# EAGLE design pico test (EAGLE 7.1.0)
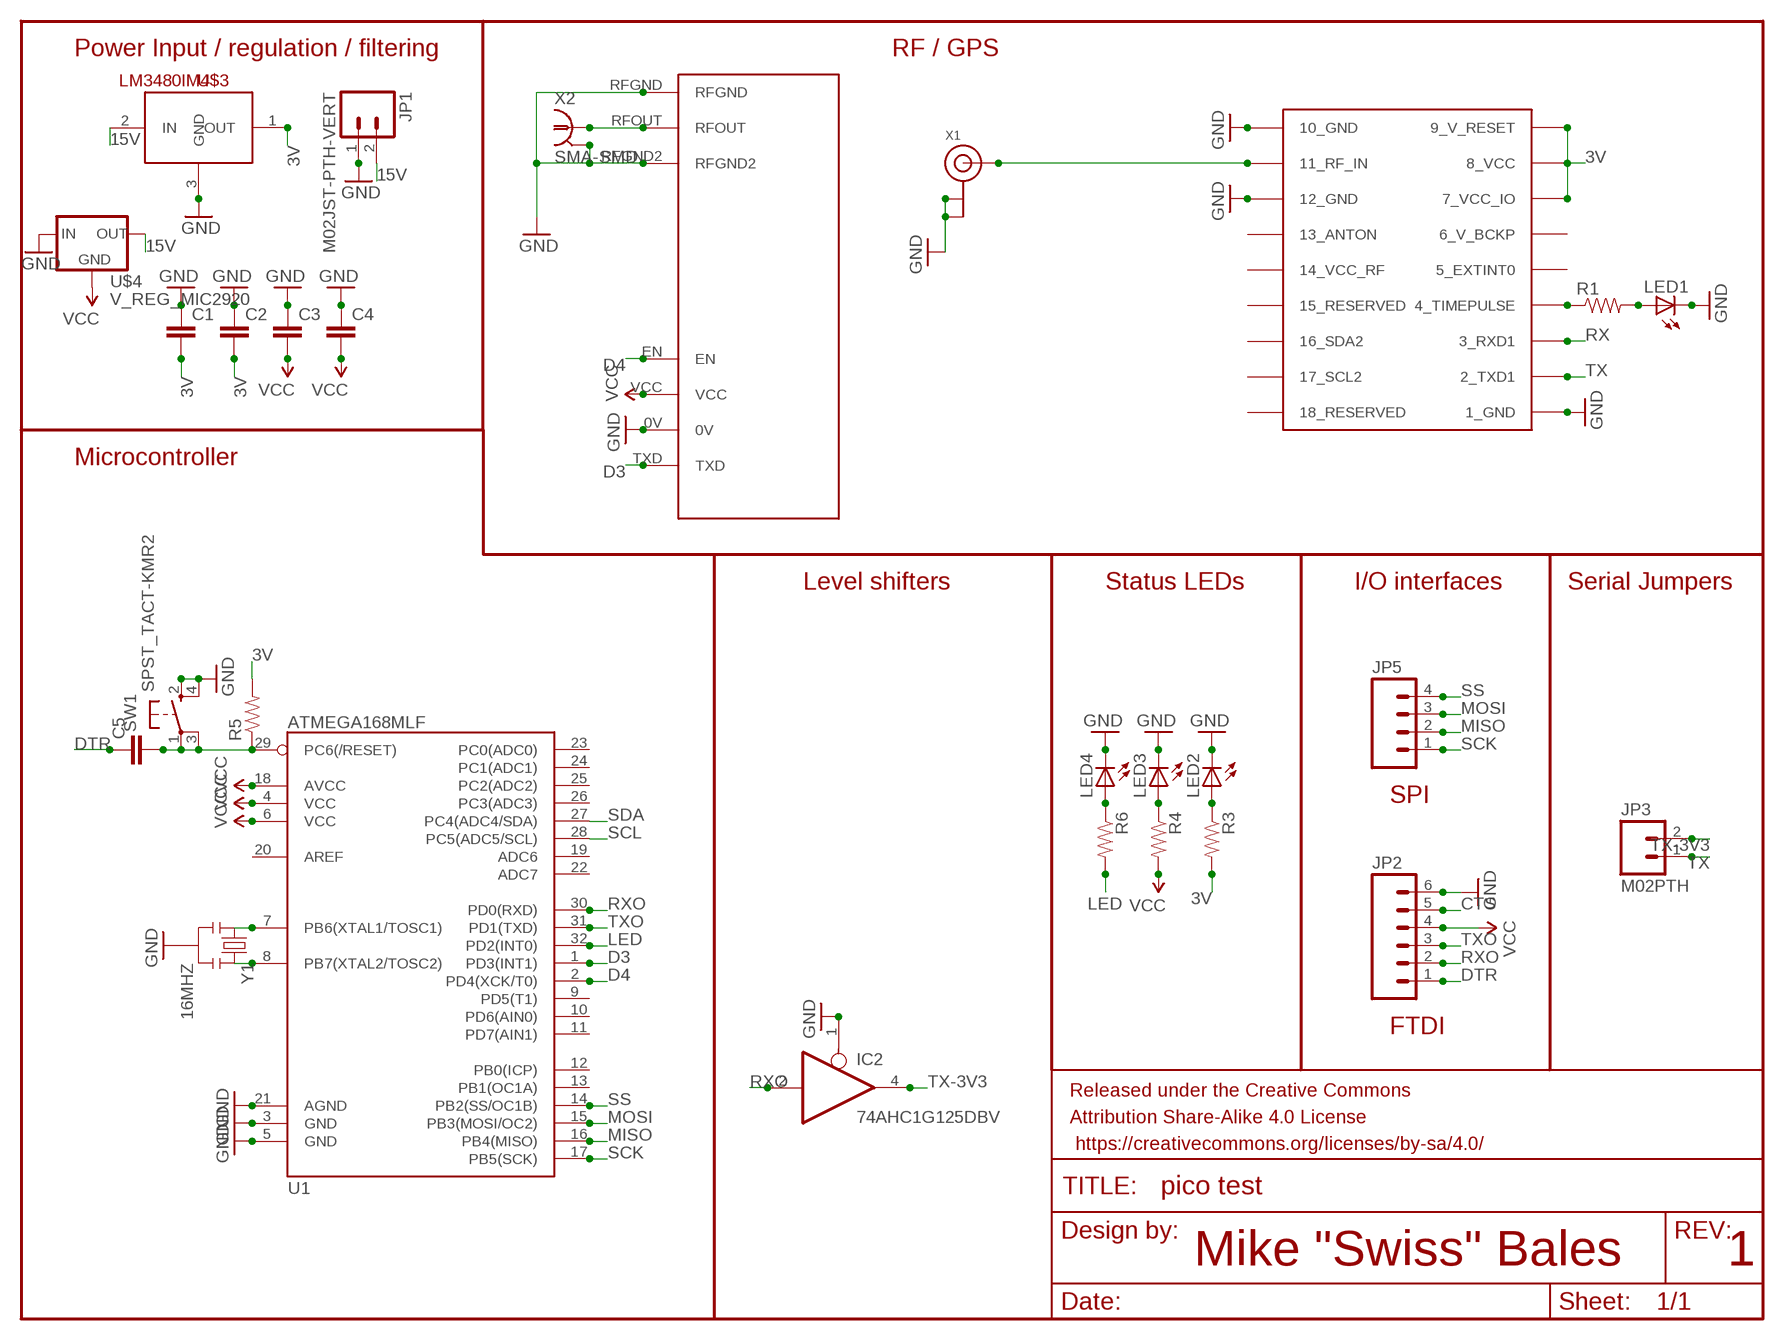
[diagram p0: schematic, sheet 1]

## Parts
C1  CAP0805  [0805]
C2  CAP0805  [0805]
C3  CAP0805  [0805]
C4  CAP0805  [0805]
C5  CAP0805  [0805]
FRAME1  FRAME-LETTER  [CREATIVE_COMMONS]
IC2  74AHC1G125DBV  [SOT23-5]
JP1  M02JST-PTH-VERT  [JST-2-PTH-VERT]
JP2  M06NO_SILK_FEMALE_PTH  [1X06_NO_SILK]
JP3  M02PTH  [1X02]
JP5  M041X04_NO_SILK  [1X04_NO_SILK]
LED1  LEDCHIP-LED0805  [CHIP-LED0805]
LED2  LEDCHIP-LED0805  [CHIP-LED0805]
LED3  LEDCHIP-LED0805  [CHIP-LED0805]
LED4  LEDCHIP-LED0805  [CHIP-LED0805]
R1  RESISTOR0805-RES  [0805]
R3  RESISTOR0805-RES  [0805]
R4  RESISTOR0805-RES  [0805]
R5  RESISTOR0805-RES  [0805]
R6  RESISTOR0805-RES  [0805]
SW1  SPST_TACT-KMR2  [KMR2]
U1  ATMEGA168MLF  [MLF32]
U$1  UBLOX_MAX  [UBLOX_MAX]
U$2  RADIOMETRIX-HX1  [RADIOMETRIX-HX1]
U$3  LM3480IM4  [SOT23-3]
U$4  V_REG_MIC2920  [SOT223]
X1  ANTENNA_U.FL  [U.FL]
X2  SMA-SMD  [SMA-SMD]
Y1  16MHZ  RESONATOR16MHZ  [RESONATOR-SMD]

## Nets
3V: C1.2 C2.2 R3.2 R5.2 U$1.7_VCC_IO U$1.8_VCC U$1.9_V_RESET U$3.1(OUT)
15V: JP1.2 U$3.2(IN) U$4.3(OUT)
CTS: JP2.5
D3: U1.1(PD3(INT1)) U$2.TXD
D4: U1.2(PD4(XCK/T0)) U$2.EN
DTR: C5.1 JP2.1
GND: C1.1 C2.1 C3.1 C4.1 IC2.1(OE) JP1.1 JP2.6 LED1.C LED2.C LED3.C LED4.C SW1.2(S) SW1.4(S1) U1.3(GND) U1.5(GND) U1.21(AGND) U$1.1_GND U$1.10_GND U$1.12_GND U$2.0V U$2.RFGND U$2.RFGND2 U$3.3(GND) U$4.1(IN) X1.1(GND) X1.2(GND) X2.2@1 X2.2@2 X2.2@3 X2.2@4 X2.2@5 X2.2@6 Y1.2
LED: R6.2 U1.32(PD2(INT0))
MISO: JP5.2 U1.16(PB4(MISO))
MOSI: JP5.3 U1.15(PB3(MOSI/OC2))
N$1: U$2.RFOUT X2.1
N$2: R1.1 U$1.4_TIMEPULSE
N$3: LED1.A R1.2
N$6: U$1.11_RF_IN X1.3(SIGNAL)
N$7: LED2.A R3.1
N$8: LED3.A R4.1
N$9: C5.2 R5.1 SW1.1(P) SW1.3(P1) U1.29(PC6(/RESET))
N$14: U1.8(PB7(XTAL2/TOSC2)) Y1.3
N$26: U1.7(PB6(XTAL1/TOSC1)) Y1.1
N$27: LED4.A R6.1
RX: U$1.3_RXD1
RXO: IC2.2(I) JP2.2 U1.30(PD0(RXD))
SCK: JP5.1 U1.17(PB5(SCK))
SCL: U1.28(PC5(ADC5/SCL))
SDA: U1.27(PC4(ADC4/SDA))
SS: JP5.4 U1.14(PB2(SS/OC1B))
TX: JP3.1 U$1.2_TXD1
TX-3V3: IC2.4(O) JP3.2
TXO: JP2.3 U1.31(PD1(TXD))
VCC: C3.2 C4.2 JP2.4 R4.2 U1.4(VCC) U1.6(VCC) U1.18(AVCC) U$2.VCC U$4.2(GND)
Unconnected: U1.9(PD5(T1)) U1.10(PD6(AIN0)) U1.11(PD7(AIN1)) U1.12(PB0(ICP)) U1.13(PB1(OC1A)) U1.19(ADC6) U1.20(AREF) U1.22(ADC7) U1.23(PC0(ADC0)) U1.24(PC1(ADC1)) U1.25(PC2(ADC2)) U1.26(PC3(ADC3)) U$1.5_EXTINT0 U$1.6_V_BCKP U$1.13_ANTON U$1.14_VCC_RF U$1.15_RESERVED U$1.16_SDA2 U$1.17_SCL2 U$1.18_RESERVED

## Notes on the sheet
- Power Input / regulation / filtering | RF / GPS
- Microcontroller
- Level shifters | Status LEDs | I/O interfaces | Serial Jumpers
- SPI
- FTDI
- Mike "Swiss" Bales | 1

## Power pins joined to a net without a drawn wire
GND: IC2.3(GND)
VCC: IC2.5(VCC)

## Library data of the parts
C1-C5 = SparkFun-Capacitors:CAP: Capacitor Standard 0603 ceramic capacitor, and 0.1" leaded capacitor.
FRAME1 = SparkFun-Aesthetics:FRAME-LETTER: Schematic Frame Standard 8.5x11 US Letter frame
IC2 = 74xx-little-us:74*1G125: Single Bus Buffer Gate with 3-State Output
JP1 JP3 = SparkFun-Connectors:M02: Standard 2-pin 0.1" header. Use with - straight break away headers ( PRT-00116) - right angle break away headers (PRT-00553) - swiss pins (PRT-00743) - machine pins (PRT-00117) - female headers (PRT-00115) Molex polarized connector foot print use with: PRT-08233 with associated crimp pins and housings. 2.54_SCREWTERM for use with PRT-10571. 3.5mm Screw Terminal footprints for PRT-08084 5mm Screw Terminal footprints for use with PRT-08432
JP2 = SparkFun-Connectors:M06: Header 6 Standard 6-pin 0.1" header. Use with straight break away headers (SKU : PRT-00116), right angle break away headers (PRT-00553), swiss pins (PRT-00743), machine pins (PRT-00117), and female headers (PRT-00115). Molex polarized connector foot print use with SKU : PRT-08094 with associated crimp pins and housings. NOTES ON THE VARIANTS LOCK and LOCK_LONGPADS... This footprint was designed to help hold the alignment of a through-hole component (i.e. 6-pin header) while soldering it into place. You may notice that each hole has been shifted either up or down by 0.005 of an inch from it's more standard position (which is a perfectly straight line). This slight alteration caused the pins (the squares in the middle) to touch the edges of the holes. Because they are alternating, it causes a "brace" to hold the component in place. 0.005 has proven to be the perfect amount of "off-center" position when using our standard breakaway headers. Although looks a little odd when you look at the bare footprint, once you have a header in there, the alteration is very hard to notice. Also,if you push a header all the way into place, it is covered up entirely on the bottom side. This idea of altering the position of holes to aid alignment will be further integrated into the Sparkfun Library for other footprints. It can help hold any component with 3 or more connection pins.; PROD_ID: CONN-08437
JP5 = SparkFun-Connectors:M04: Header 4 Standard 4-pin 0.1" header. Use with straight break away headers (SKU : PRT-00116), right angle break away headers (PRT-00553), swiss pins (PRT-00743), machine pins (PRT-00117), and female headers (PRT-00115). Molex polarized connector foot print use with SKU : PRT-08231 with associated crimp pins and housings. 1MM SMD Version SKU: PRT-10208
LED1-LED4 = adafruit:LED: LED OSRAM: - CHIPLED LG R971, LG N971, LY N971, LG Q971, LY Q971, LO R971, LY R971 LH N974, LH R974 LS Q976, LO Q976, LY Q976 LO Q996 - Hyper CHIPLED LW Q18S LB Q993, LB Q99A, LB R99A - SideLED LS A670, LO A670, LY A670, LG A670, LP A670 LB A673, LV A673, LT A673, LW A673 LH A674 LY A675 LS A676, LA A676, LO A676, LY A676, LW A676 LS A679, LY A679, LG A679 - Hyper Micro SIDELED® LS Y876, LA Y876, LO Y876, LY Y876 LT Y87S - SmartLED LW L88C, LW L88S LB L89C, LB L89S, LG L890 LS L89K, LO L89K, LY L89K LS L896, LA L896, LO L896, LY L896 - TOPLED LS T670, LO T670, LY T670, LG T670, LP T670 LSG T670, LSP T670, LSY T670, LOP T670, LYG T670 LG T671, LOG T671, LSG T671 LB T673, LV T673, LT T673, LW T673 LH T674 LS T676, LA T676, LO T676, LY T676, LB T676, LH T676, LSB T676, LW T676 LB T67C, LV T67C, LT T67C, LS T67K, LO T67K, LY T67K, LW E67C LS E67B, LA E67B, LO E67B, LY E67B, LB E67C, LV E67C, LT E67C LW T67C LS T679, LY T679, LG T679 LS T770, LO T770, LY T770, LG T770, LP T770 LB T773, LV T773, LT T773, LW T773 LH T774 LS E675, LA E675, LY E675, LS T675 LS T776, LA T776, LO T776, LY T776, LB T776 LHGB T686 LT T68C, LB T68C - Hyper Mini TOPLED® LB M676 - Mini TOPLED Santana® LG M470 LS M47K, LO M47K, LY M47K Source: http://www.osram.convergy.de/
R1 R3-R6 = SparkFun-Resistors:RESISTOR: Resistor Basic schematic elements and footprints for 0603, 1206, and PTH resistors.
SW1 = adafruit:SPST_TACT: SMT 6mm switch, EVQQ2 series http://www.ladyada.net/library/eagle
U1 = SparkFun-DigitalIC:ATMEGA168: Atmel 32-pin 8-bit micro, 16k flash.
U$1 = Ava:UBLOX_MAX: UBLOX MAX
U$2 = Ava:RADIOMETRIX-HX1
U$3 = SparkFun-PowerIC:LM3480IM4: Small package linear regulator
U$4 = SparkFun-PowerIC:V_REG_MIC2920: MIC2920A (http://www.micrel.com/_PDF/mic2920.pdf) - 400mA output LDO Regulator
X1 = adafruit:ANTENNA_U.FL: U.FL Antenna Connector
X2 = con-coax:SMA-SMD: SMA 50 Ohm Straight Jack Receptacle - Surface Mount www.johnsoncomponents.com Source: http://catalog.digikey.com .. 142-0711-201, 205, 202, 206.pdf; OC_FARNELL: unknown; OC_NEWARK: unknown
Y1 = SparkFun-FreqCtrl:RESONATOR: Resonator Small SMD resonator. Used, eg, on the Arduino Pro/ Pro Mini boards. 8MHz- XTAL-08895 16MHz- XTAL-08900; PROD_ID: XTAL-08900

## Board
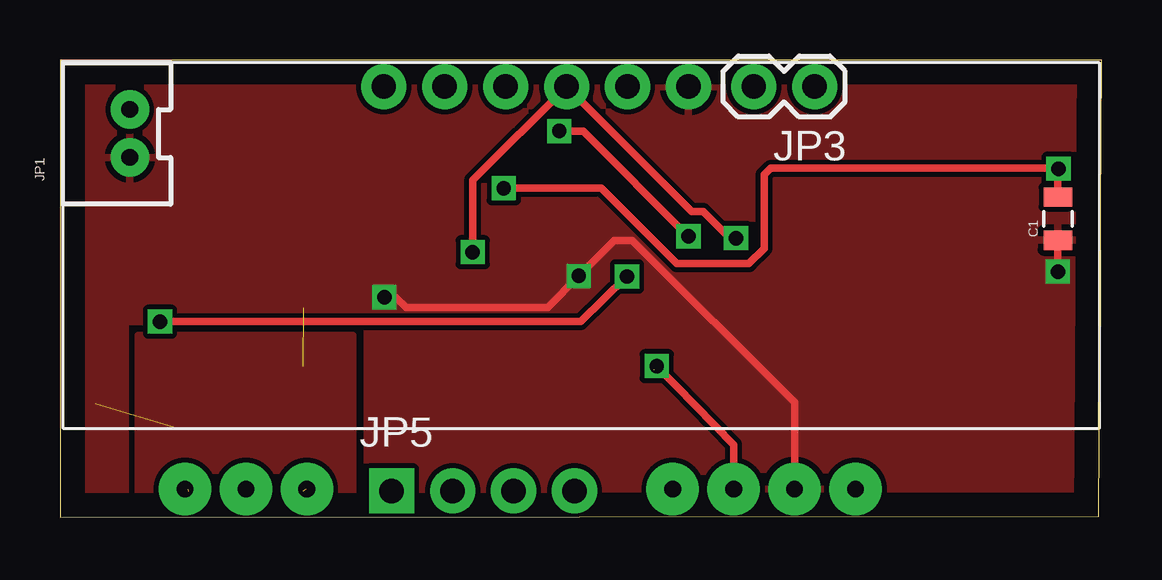
[diagram p1: board, top side]
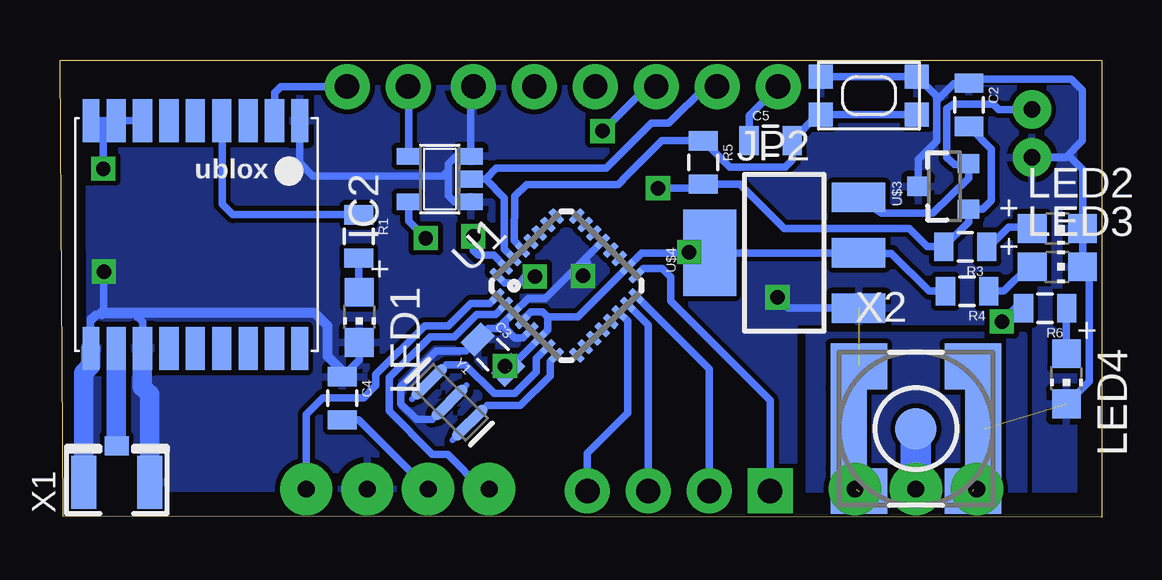
[diagram p2: board, bottom side, seen from below]

Size 43.41 x 19.07 mm. Coordinates in mm from the lower left corner, seen from the top.
Outline: 0,0 43.28,0.03 43.41,19.07 0,19.07 0,0
Copper layers (1*16): Top 0.035mm / dielectric 1.5mm / Bottom 0.035mm
Design rules "default": minimum track width 10mil, minimum drill 24mil, track to track 8mil, track to pad 8mil, pad to pad 8mil, via to via 8mil, smd to smd 8mil, copper to edge 40mil, drill to drill 8mil, minimum pad ring 10mil, minimum via ring 8mil, stop-mask expansion 4mil, vias tented up to drill 0mil, thermal gap 10mil

### Footprints (pad centres in the part's own frame; a part is rotated, then mirrored left to right if it is on the bottom)
0805 = smd 0.8 x 1.2: 1 -0.9,0; 2 0.9,0
SOT23-5 = smd 0.69 x 0.99: 1 -0.95,-1.29; 2 0,-1.29; 3 0.95,-1.29; 4 0.95,1.3; 5 -0.95,1.3
JST-2-PTH-VERT = drill 0.7 pad 1.6: 1 -1,-0.55; 2 1,-0.55
1X06_NO_SILK = drill 1.016 pad 1.88: 1 0,0; 2 2.54,0; 3 5.08,0; 4 7.62,0; 5 10.16,0; 6 12.7,0
1X02 = drill 1.016 pad 1.88: 1 0,0; 2 2.54,0
1X04_NO_SILK = drill 1.016 pad 1.88 square: 1 0,0 | drill 1.016 pad 1.88: 2 2.54,0; 3 5.08,0; 4 7.62,0
CHIP-LED0805 = smd 1.2 x 1.2: A 0,-1.05; C 0,1.05
KMR2 = smd 1 x 1: 1 2,0.8; 2 2,-0.8; 3 -2,0.8; 4 -2,-0.8
MLF32 = smd 0.7 x 0.3: 1 -2.35,1.75; 2 -2.35,1.25; 3 -2.35,0.75; 4 -2.35,0.25; 5 -2.35,-0.25; 6 -2.35,-0.75; 7 -2.35,-1.25; 8 -2.35,-1.75; 17 2.35,-1.75; 18 2.35,-1.25; 19 2.35,-0.75; 20 2.35,-0.25; 21 2.35,0.25; 22 2.35,0.75; 23 2.35,1.25; 24 2.35,1.75 | smd 0.3 x 0.7: 9 -1.75,-2.35; 10 -1.25,-2.35; 11 -0.75,-2.35; 12 -0.25,-2.35; 13 0.25,-2.35; 14 0.75,-2.35; 15 1.25,-2.35; 16 1.75,-2.35; 25 1.75,2.35; 26 1.25,2.35; 27 0.75,2.35; 28 0.25,2.35; 29 -0.25,2.35; 30 -0.75,2.35; 31 -1.25,2.35; 32 -1.75,2.35
UBLOX_MAX = smd 1.8 x 0.7: 1_GND 4.95,-4.4; 9_V_RESET 4.95,4.3; 10_GND -4.55,4.3; 18_RESERVED -4.55,-4.4 | smd 1.8 x 0.8: 2_TXD1 4.95,-3.35; 3_RXD1 4.95,-2.25; 4_TIMEPULSE 4.95,-1.15; 5_EXTINT0 4.95,-0.05; 6_V_BCKP 4.95,1.05; 7_VCC_IO 4.95,2.15; 8_VCC 4.95,3.25; 11_RF_IN -4.55,3.25; 12_GND -4.55,2.15; 13_ANTON -4.55,1.05; 14_VCC_RF -4.55,-0.05; 15_RESERVED -4.55,-1.15; 16_SDA2 -4.55,-2.25; 17_SCL2 -4.55,-3.35
RADIOMETRIX-HX1 = drill 0.7 pad 2.184: 0V 8.89,-10.16; EN 3.81,-10.16; RFGND -11.43,-10.16; RFGND2 -16.51,-10.16; RFOUT -13.97,-10.16; TXD 11.43,-10.16; VCC 6.35,-10.16
SOT23-3 = smd 0.8 x 0.9: 1 -0.95,-1; 2 0.95,-1; 3 0,1.1
SOT223 = smd 1.219 x 2.235: 1 -2.311,-3.099; 2 0,-3.099; 3 2.311,-3.099 | smd 3.6 x 2.2: 4 0,3.099
U.FL = smd 2.2 x 1.05: 1 0,1.375; 2 0,-1.375 | smd 0.8 x 1: 3 1.525,0
SMA-SMD = smd 1.73 x 1.73: 1 0,0 | smd 2.35 x 1.9: 2@1 -2.375,2.6; 2@2 -2.375,-2.6; 2@3 2.375,-2.6; 2@4 2.375,2.6 | smd 1.5 x 3.4: 2@5 -2.8,0; 2@6 2.8,0
RESONATOR-SMD = smd 0.45 x 1.905: 1 -1.2,0; 2 0,0; 3 1.2,0

### Placement (x,y rotation side)
C1  41.58,12.45 90 top
C2  5.54,17.2 270 bottom
C3  25.37,6.78 315 bottom
C4  31.65,4.95 270 bottom
C5  13.8,15.71 0 bottom
FRAME1  14.4,-8.13 0 top  (outside the outline)
IC2  27.58,14.1 90 bottom
JP1  2.36,16 90 top
JP2  13.49,17.96 180 bottom
JP3  31.45,17.96 180 top
JP5  13.82,1.09 0 top
LED1  30.94,8.33 180 bottom
LED2  1.85,12.04 270 bottom
LED3  1.85,10.44 270 bottom
LED4  1.47,5.77 180 bottom
R1  30.96,11.71 270 bottom
R3  5.69,11.28 180 bottom
R4  5.61,9.42 180 bottom
R5  16.6,14.79 270 bottom
R6  2.36,8.71 180 bottom
SW1  9.7,17.58 180 bottom
U1  22.3,9.65 45 bottom
U$1  37.82,11.58 90 bottom
U$2  21.72,11.33 0 top
U$3  6.55,13.79 90 bottom
U$4  13.23,11.02 90 bottom
X1  41.05,1.45 90 bottom
X2  7.75,3.68 0 bottom
Y1  27.18,4.78 315 bottom

### Tracks (layer width: path | path; a pad name or v marks a point on that pad's centre or on a via)
3V  (via drill 0.6)
  Top 0.305: C1.2 41.58,14.5 v41.61,14.53 41.58,14.55 29.62,14.55 29.34,14.27 29.34,11.2 28.7,10.57 25.71,10.57 22.56,13.72 v18.49,13.72
  Bottom 0.305: C2.2 4.6,15.36 4.6,13.21 4.96,12.84 U$3.1 5.55,12.31 R3.2 7.26,11.28 8.03,12.04 13.23,12.04 15.09,13.89 R5.2 16.78,13.72 v18.49,13.72 | U$1.9_V_RESET 41.63,16.53 | 41.63,16.53 U$1.8_VCC U$1.7_VCC_IO | v41.61,14.53 41.61,16.51 41.63,16.53
15V
  Bottom 0.305: JP1.2 4.3,17 4.52,17.22 6.17,17.22 6.45,17.04 6.45,14.99 6.12,14.71 5.59,14.71 U$3.2 5.55,14.13 7.04,12.67 9.2,12.67 U$4.3
D3
  Bottom 0.305: U1.1 25.51,8.92 26.29,8.92 27.23,7.98 28.22,7.98 30.25,5.94 30.25,5.49 30.76,4.98 32.46,4.98 33.15,4.29 U$2.TXD
D4
  Bottom 0.305: U1.2 25.26,8.46 26.04,8.46 26.98,7.52 27.99,7.52 29.69,5.82 29.69,4.42 27.89,2.62 27.25,2.62 25.81,1.17 U$2.EN
DTR
  Bottom 0.305: C5.1 14.7,16.75 JP2.1
GND  (via drill 0.6)  (4 unrouted)
  Top 0.305: v13.51,9.17 14,9.17 14.43,8.74 20.32,8.74 v21.62,10.06 23.09,11.53 23.85,11.53 30.61,4.77 U$2.0V | C1.1 v41.58,10.24
  Bottom 0.305: LED4.C 0.53,5.66 0.53,10.17 LED3.C LED2.C 0.8,14.49 1.32,15.01 2.9,15.01 JP1.1 1.51,15 0.81,15.7 0.81,17.81 1.27,18.26 5.37,18.26 C2.1 5.55,18.08 6.17,18.08 6.88,17.37 | U$3.3 7.65,14.9 6.88,15.67 6.88,17.37 | 6.88,17.37 6.88,17.56 SW1.4 SW1.2 | 27.9,4.07 28.55,4.07 29.21,4.72 29.21,5.46 27.74,6.93 26.5,6.93 C3.1 25.56,7.87 25.17,7.87 24.87,8.18 | 24.87,8.18 24.53,8.52 U1.3 23.9,9.12 23.19,9.12 21.56,10.74 | U1.5 24.13,7.47 24.46,7.47 24.87,7.87 24.87,8.18 | U1.21 21.56,10.74 | C4.1 30.94,6.56 LED1.C | IC2.1 26.96,13.15 27.23,13.41 27.23,14.45 | 27.23,14.45 27.23,14.73 26.95,15.01 26.33,15.01 IC2.3 26.29,17.85 JP2.6 | U$1.1_GND 33.42,14.78 32.87,14.22 27.46,14.22 27.23,14.45 | U$1.12_GND 39.97,8.14 40.28,8.46 41.66,8.46 41.94,8.46 42.14,8.25 42.14,8.13 | 42.14,8.13 42.14,7.05 U$1.10_GND | v21.62,10.06 21.41,10.59 21.56,10.74 | v41.58,10.24 41.58,8.69 42.14,8.13 | U$4.1 13.06,8.71 v13.51,9.17
  Bottom 0.406: X2.2@6 4.95,1.17 U$2.RFGND2 5.33,1.17 5.33,6.15 5.37,6.15 X2.2@4 | X2.2@2 10.55,1.08 X2.2@5 | U$2.RFGND 10.24,1.17 10.24,6.27 X2.2@1 | C4.1 31.65,6.1 32.26,6.71 32.26,7.98 32.79,8.51 41.61,8.51 41.66,8.46
  Bottom 0.813: U$1.10_GND 42.12,6.32 42.42,6.02 X1.1 | X1.2 39.67,5.13 39.98,5.44 U$1.12_GND
  pour Top: 12.8,0.03 12.8,8.15 2.72,8.15 2.72,0.03 0.1,0.03 0.1,18.95 43.36,18.95 43.36,-0.03 12.8,-0.03 12.73,-0.03 12.73,0.18
  pour Bottom: 12.83,0 12.83,8.15 2.74,8.15 2.74,0 0.08,0 0.08,18.95 43.36,18.95 43.36,0
LED  (via drill 0.6)
  Top 0.305: v4.17,8.15 21.69,8.15 v23.62,10.03
  Bottom 0.305: R6.2 3.61,8.71 v4.17,8.15 | v23.62,10.03 24.05,10.03 24.23,9.75 24.88,9.75 U1.32
MISO
  Bottom 0.305: U1.16 16.36,6.18 JP5.2
MOSI
  Bottom 0.305: U1.15 18.9,8.02 JP5.3
N$1
  Bottom 1.27: U$2.RFOUT X2.1
N$2
  Bottom 0.305: R1.1 36.21,12.61 36.65,13.06 36.65,16.51 U$1.4_TIMEPULSE
N$3
  Bottom 0.305: LED1.A 30.96,9.41 R1.2
N$6
  Bottom 0.305: 41.07,3 X1.3
  Bottom 0.813: 41.07,3 U$1.11_RF_IN
N$7
  Bottom 0.305: R3.1 4.7,11.28 3.89,12.09 2.96,12.09 LED2.A
N$8
  Bottom 0.305: LED3.A 3.07,10.44 4.09,9.42 R4.1
N$9
  Bottom 0.305: SW1.3 SW1.1 11.83,16.78 C5.2 12.9,14.89 13.18,14.6 15.51,14.6 R5.1 18.34,15.69 19.96,14.07 19.96,14.05 20.14,13.87 23.95,13.87 24.46,13.39 24.49,11.53 24.14,11.19 U1.29
N$12
  pour Top: 3.25,-0.03 3.25,7.57 12.19,7.57 12.19,-0.03
N$13
  pour Bottom: 3.25,-0.03 3.25,7.57 12.19,7.57 12.19,-0.03
N$14
  Bottom 0.305: U1.8 22.99,6.49 22.99,5.89 24.23,4.65 25.61,4.65
N$26
  Bottom 0.305: U1.7 23.57,6.61 23.57,6.04 24.46,5.16 25.32,5.16 26.52,6.35 27.31,6.35
N$27
  Bottom 0.305: LED4.A 1.47,8.42 R6.1
RXO
  Bottom 0.305: U1.30 24.89,11.18 24.89,13.31 25.68,14.1 | 25.68,14.1 IC2.2 | JP2.2 16.51,17.96 18.03,16.43 18.77,16.43 20.65,14.55 25.22,14.55 25.68,14.1
SCK
  Bottom 0.305: U1.17 19.12,10.36 18.31,10.36 17.96,10.01 17.96,9.02 13.82,4.88 JP5.1
SS
  Bottom 0.305: U1.14 19.76,8.17 19.76,4.34 21.44,2.67 JP5.4
TX
  Bottom 0.305: JP3.1 34.21,17.96 34.47,17.7 U$1.2_TXD1
TX-3V3
  Bottom 0.305: IC2.4 28.88,17.94 JP3.2
TXO  (via drill 0.6)
  Top 0.305: v20.8,16.1 21.79,16.1 v26.19,11.71
  Bottom 0.305: JP2.3 18.95,17.96 v20.8,16.1 | v26.19,11.71 26.19,11.12 25.98,10.92 25.34,10.92 U1.31
VCC  (via drill 0.6)  (1 unrouted)
  Top 0.305: U$2.VCC 28.07,3.02 v24.87,6.3 | v28.17,11.63 27.91,11.63 26.8,12.75 26.31,12.75 JP2.4 17.2,14.05 v17.2,11.05
  Bottom 0.305: 23.09,8.36 23.09,7.8 U1.6 C3.2 v24.87,6.3 | 23.09,8.36 23.29,8.56 23.8,8.56 24.14,8.22 U1.4 | 23.09,8.36 21.83,8.36 U1.18 19.16,11.02 17.17,11.02 | U$2.VCC 30.95,4.05 C4.2 | R4.2 7.19,9.42 8.76,11 10.11,11 U$4.2 16.71,11.02 17.17,11.02 | IC2.5 28.88,12.35 v28.17,11.63 | 17.17,11.02 v17.2,11.05